# EAGLE schematic BME688 (EAGLE 9.6.2)
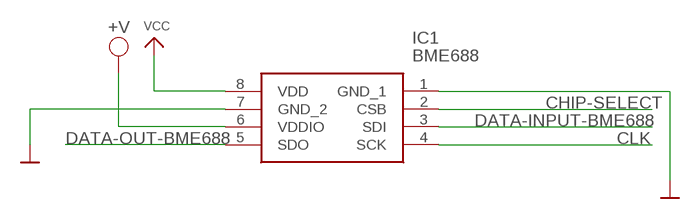
[diagram p0: schematic, sheet 1]

## Parts
IC1  BME688  [BME688]

## Nets
+V: IC1.6(VDDIO)
CHIP-SELECT: IC1.2(CSB)
CLK: IC1.4(SCK)
DATA-INPUT-BME688: IC1.3(SDI)
DATA-OUT-BME688: IC1.5(SDO)
GND: IC1.1(GND_1) IC1.7(GND_2)
VCC: IC1.8(VDD)

## Library data of the parts
IC1 = BME688:BME688: Gas sensor measuring relative humidity, barometric pressure, ambient temperature and gas (VOC) Source: Datasheet <https://www.bosch-sensortec.com/media/boschsensortec/downloads/datasheets/bst-bme688-ds000.pdf>; DESCRIPTION: Gas sensor measuring relative humidity, barometric pressure, ambient temperature and gas (VOC); HEIGHT: 1mm; MANUFACTURER_NAME: BOSCH; MANUFACTURER_PART_NUMBER: BME688; MOUSER_PART_NUMBER: 262-BME688; MOUSER_PRICE-STOCK: https://www.mouser.co.uk/ProductDetail/Bosch-Sensortec/BME688?qs=IS%252B4QmGtzzqQoVDscqwx3A%3D%3D